# Altium project TempController.PrjPCB
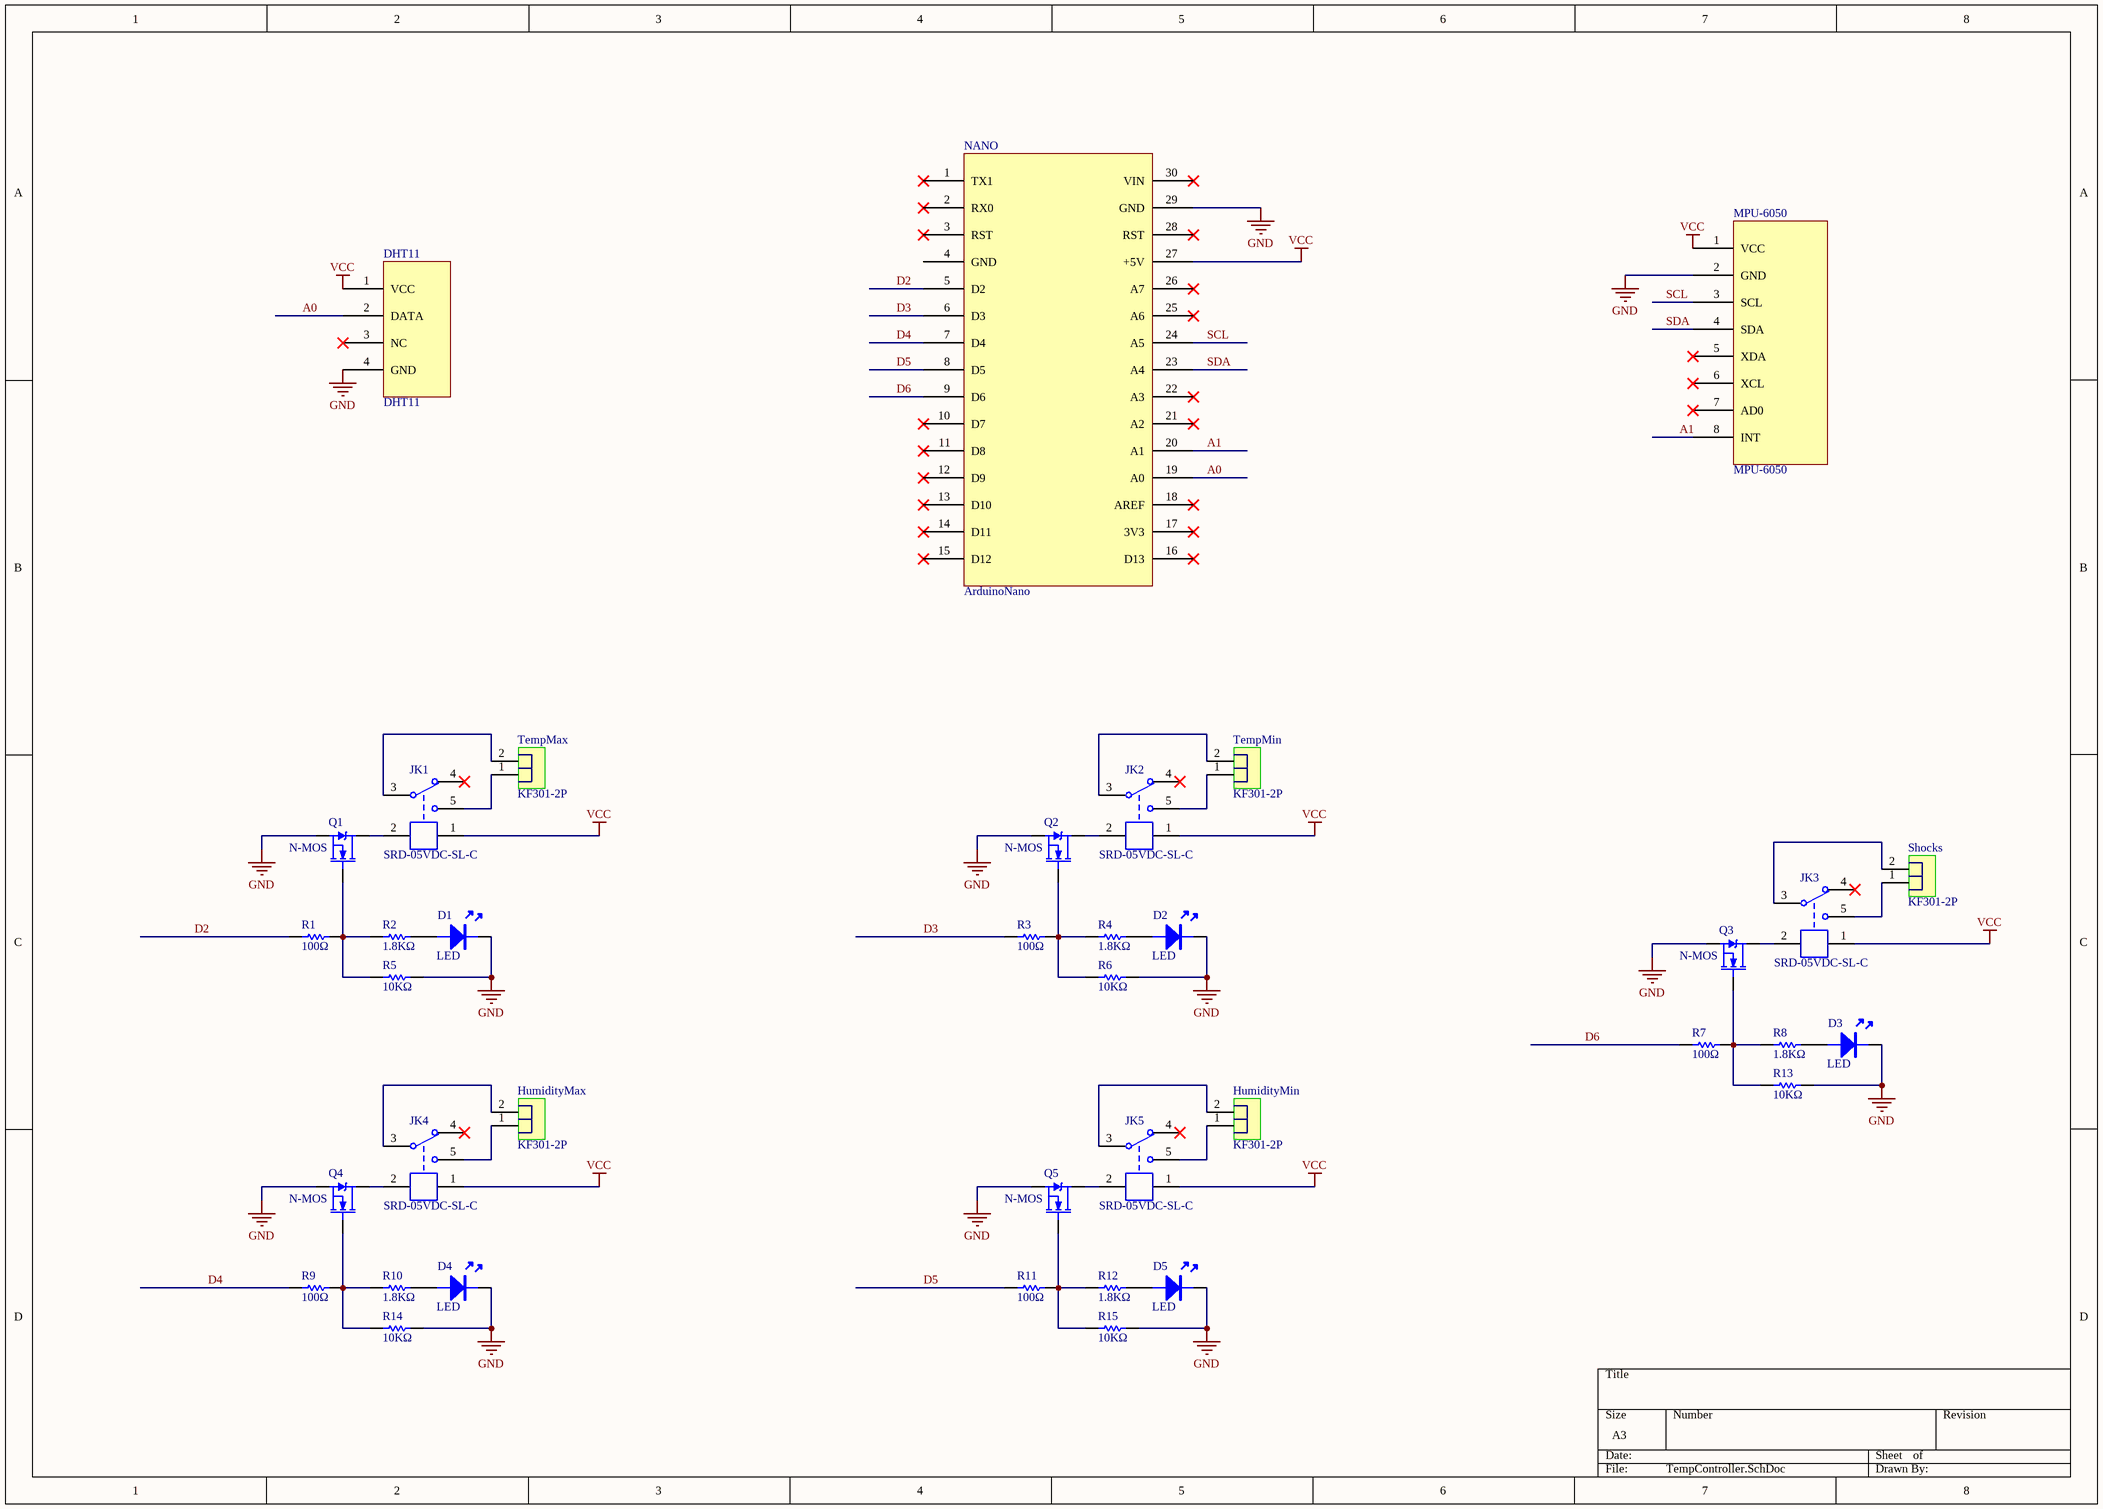
[diagram p0: TempController.SchDoc]
1 sheet, 38 parts. Net scope: global (net labels, ports and power ports of the same name join across sheets).
Board file: TempController.PcbDoc

## Sheet TempController.SchDoc
size A3

### Parts
D1  LED  [LED-0805Y]
D2  LED  [LED-0805Y]
D3  LED  [LED-0805Y]
D4  LED  [LED-0805Y]
D5  LED  [LED-0805Y]
DHT11  DHT11  [DHT11]
HumidityMax  KF301-2P  [KF128-3.81-2P]
HumidityMin  KF301-2P  [KF128-3.81-2P]
JK1  SRD-05VDC-SL-C  [SRD-C_B]
JK2  SRD-05VDC-SL-C  [SRD-C_B]
JK3  SRD-05VDC-SL-C  [SRD-C_B]
JK4  SRD-05VDC-SL-C  [SRD-C_B]
JK5  SRD-05VDC-SL-C  [SRD-C_B]
MPU-6050  MPU-6050  [MPU-6050]
NANO  ArduinoNano  [ArduinoNano]
Q1  N-MOS  [TO252]
Q2  N-MOS  [TO252]
Q3  N-MOS  [TO252]
Q4  N-MOS  [TO252]
Q5  N-MOS  [TO252]
R1  100Ω  [0805R]
R2  1.8KΩ  [0805R]
R3  100Ω  [0805R]
R4  1.8KΩ  [0805R]
R5  10KΩ  [0805R]
R6  10KΩ  [0805R]
R7  100Ω  [0805R]
R8  1.8KΩ  [0805R]
R9  100Ω  [0805R]
R10  1.8KΩ  [0805R]
R11  100Ω  [0805R]
R12  1.8KΩ  [0805R]
R13  10KΩ  [0805R]
R14  10KΩ  [0805R]
R15  10KΩ  [0805R]
Shocks  KF301-2P  [KF128-3.81-2P]
TempMax  KF301-2P  [KF128-3.81-2P]
TempMin  KF301-2P  [KF128-3.81-2P]

### Nets
GND: D1.K D2.K D3.K D4.K D5.K DHT11.4(GND) MPU-6050.2(GND) NANO.29(GND) Q1.S Q2.S Q3.S Q4.S Q5.S R5.2 R6.2 R13.2 R14.2 R15.2
VCC: DHT11.1(VCC) JK1.1 JK2.1 JK3.1 JK4.1 JK5.1 MPU-6050.1(VCC) NANO.27(+5V)
A0: DHT11.2(DATA) NANO.19(A0)
A1: MPU-6050.8(INT) NANO.20(A1)
D2: NANO.5(D2) R1.1
D3: NANO.6(D3) R3.1
D4: NANO.7(D4) R9.1
D5: NANO.8(D5) R11.1
D6: NANO.9(D6) R7.1
SCL: MPU-6050.3(SCL) NANO.24(A5)
SDA: MPU-6050.4(SDA) NANO.23(A4)
NetD1_A: D1.A R2.2
NetD2_A: D2.A R4.2
NetD3_A: D3.A R8.2
NetD4_A: D4.A R10.2
NetD5_A: D5.A R12.2
NetHumidityMax_1: HumidityMax.1 JK4.5
NetHumidityMax_2: HumidityMax.2 JK4.3
NetHumidityMin_1: HumidityMin.1 JK5.5
NetHumidityMin_2: HumidityMin.2 JK5.3
NetJK1_2: JK1.2 Q1.D
NetJK1_3: JK1.3 TempMax.2
NetJK1_5: JK1.5 TempMax.1
NetJK2_2: JK2.2 Q2.D
NetJK2_3: JK2.3 TempMin.2
NetJK2_5: JK2.5 TempMin.1
NetJK3_2: JK3.2 Q3.D
NetJK3_3: JK3.3 Shocks.2
NetJK3_5: JK3.5 Shocks.1
NetJK4_2: JK4.2 Q4.D
NetJK5_2: JK5.2 Q5.D
NetQ1_G: Q1.G R1.2 R2.1 R5.1
NetQ2_G: Q2.G R3.2 R4.1 R6.1
NetQ3_G: Q3.G R7.2 R8.1 R13.1
NetQ4_G: Q4.G R9.2 R10.1 R14.1
NetQ5_G: Q5.G R11.2 R12.1 R15.1

Not connected (* = marked no-connect by the designer): DHT11 3(NC)*; JK1 4*; JK2 4*; JK3 4*; JK4 4*; JK5 4*; MPU-6050 5(XDA)* 6(XCL)* 7(AD0)*; NANO 1(TX1)* 2(RX0)* 3(RST)* 4(GND) 10(D7)* 11(D8)* 12(D9)* 13(D10)* 14(D11)* 15(D12)* 16(D13)* 17(3V3)* 18(AREF)* 21(A2)* 22(A3)* 25(A6)* 26(A7)* 28(RST)* 30(VIN)*

### Library data of the parts
HumidityMax HumidityMin Shocks TempMax TempMin = KF128-2P
JK1-JK5 = SRD-05VDC-SL-C: 5V一组转换
Q1-Q5 = N-MOS: N沟道场效应管
R1-R15 = RES